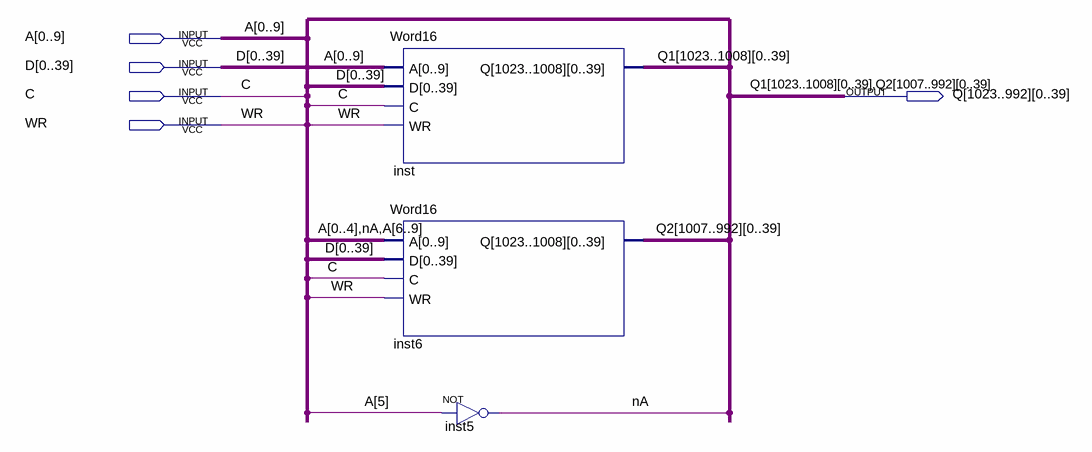
[diagram p0: schematic sheet]
// Quartus schematic Word32.bdf as structural Verilog: 3 symbols, 5 pins
module Word32 (
  input  [0:9] A,
  input  [0:39] D,
  input  C,
  input  WR,
  output [39:0] Q_1023,
  output [39:0] Q_1022,
  output [39:0] Q_1021,
  output [39:0] Q_1020,
  output [39:0] Q_1019,
  output [39:0] Q_1018,
  output [39:0] Q_1017,
  output [39:0] Q_1016,
  output [39:0] Q_1015,
  output [39:0] Q_1014,
  output [39:0] Q_1013,
  output [39:0] Q_1012,
  output [39:0] Q_1011,
  output [39:0] Q_1010,
  output [39:0] Q_1009,
  output [39:0] Q_1008,
  output [39:0] Q_1007,
  output [39:0] Q_1006,
  output [39:0] Q_1005,
  output [39:0] Q_1004,
  output [39:0] Q_1003,
  output [39:0] Q_1002,
  output [39:0] Q_1001,
  output [39:0] Q_1000,
  output [39:0] Q_999,
  output [39:0] Q_998,
  output [39:0] Q_997,
  output [39:0] Q_996,
  output [39:0] Q_995,
  output [39:0] Q_994,
  output [39:0] Q_993,
  output [39:0] Q_992
);

  wire nA;

  Word16 inst (
    .A(A), .D(D), .C(C), .WR(WR),
    .Q({Q_1023[0], Q_1023[1], Q_1023[2], Q_1023[3], Q_1023[4], Q_1023[5], Q_1023[6], Q_1023[7], Q_1023[8], Q_1023[9], Q_1023[10], Q_1023[11], Q_1023[12], Q_1023[13], Q_1023[14], Q_1023[15], Q_1023[16], Q_1023[17], Q_1023[18], Q_1023[19], Q_1023[20], Q_1023[21], Q_1023[22], Q_1023[23], Q_1023[24], Q_1023[25], Q_1023[26], Q_1023[27], Q_1023[28], Q_1023[29], Q_1023[30], Q_1023[31], Q_1023[32], Q_1023[33], Q_1023[34], Q_1023[35], Q_1023[36], Q_1023[37], Q_1023[38], Q_1023[39], Q_1022[0], Q_1022[1], Q_1022[2], Q_1022[3], Q_1022[4], Q_1022[5], Q_1022[6], Q_1022[7], Q_1022[8], Q_1022[9], Q_1022[10], Q_1022[11], Q_1022[12], Q_1022[13], Q_1022[14], Q_1022[15], Q_1022[16], Q_1022[17], Q_1022[18], Q_1022[19], Q_1022[20], Q_1022[21], Q_1022[22], Q_1022[23], Q_1022[24], Q_1022[25], Q_1022[26], Q_1022[27], Q_1022[28], Q_1022[29], Q_1022[30], Q_1022[31], Q_1022[32], Q_1022[33], Q_1022[34], Q_1022[35], Q_1022[36], Q_1022[37], Q_1022[38], Q_1022[39], Q_1021[0], Q_1021[1], Q_1021[2], Q_1021[3], Q_1021[4], Q_1021[5], Q_1021[6], Q_1021[7], Q_1021[8], Q_1021[9], Q_1021[10], Q_1021[11], Q_1021[12], Q_1021[13], Q_1021[14], Q_1021[15], Q_1021[16], Q_1021[17], Q_1021[18], Q_1021[19], Q_1021[20], Q_1021[21], Q_1021[22], Q_1021[23], Q_1021[24], Q_1021[25], Q_1021[26], Q_1021[27], Q_1021[28], Q_1021[29], Q_1021[30], Q_1021[31], Q_1021[32], Q_1021[33], Q_1021[34], Q_1021[35], Q_1021[36], Q_1021[37], Q_1021[38], Q_1021[39], Q_1020[0], Q_1020[1], Q_1020[2], Q_1020[3], Q_1020[4], Q_1020[5], Q_1020[6], Q_1020[7], Q_1020[8], Q_1020[9], Q_1020[10], Q_1020[11], Q_1020[12], Q_1020[13], Q_1020[14], Q_1020[15], Q_1020[16], Q_1020[17], Q_1020[18], Q_1020[19], Q_1020[20], Q_1020[21], Q_1020[22], Q_1020[23], Q_1020[24], Q_1020[25], Q_1020[26], Q_1020[27], Q_1020[28], Q_1020[29], Q_1020[30], Q_1020[31], Q_1020[32], Q_1020[33], Q_1020[34], Q_1020[35], Q_1020[36], Q_1020[37], Q_1020[38], Q_1020[39], Q_1019[0], Q_1019[1], Q_1019[2], Q_1019[3], Q_1019[4], Q_1019[5], Q_1019[6], Q_1019[7], Q_1019[8], Q_1019[9], Q_1019[10], Q_1019[11], Q_1019[12], Q_1019[13], Q_1019[14], Q_1019[15], Q_1019[16], Q_1019[17], Q_1019[18], Q_1019[19], Q_1019[20], Q_1019[21], Q_1019[22], Q_1019[23], Q_1019[24], Q_1019[25], Q_1019[26], Q_1019[27], Q_1019[28], Q_1019[29], Q_1019[30], Q_1019[31], Q_1019[32], Q_1019[33], Q_1019[34], Q_1019[35], Q_1019[36], Q_1019[37], Q_1019[38], Q_1019[39], Q_1018[0], Q_1018[1], Q_1018[2], Q_1018[3], Q_1018[4], Q_1018[5], Q_1018[6], Q_1018[7], Q_1018[8], Q_1018[9], Q_1018[10], Q_1018[11], Q_1018[12], Q_1018[13], Q_1018[14], Q_1018[15], Q_1018[16], Q_1018[17], Q_1018[18], Q_1018[19], Q_1018[20], Q_1018[21], Q_1018[22], Q_1018[23], Q_1018[24], Q_1018[25], Q_1018[26], Q_1018[27], Q_1018[28], Q_1018[29], Q_1018[30], Q_1018[31], Q_1018[32], Q_1018[33], Q_1018[34], Q_1018[35], Q_1018[36], Q_1018[37], Q_1018[38], Q_1018[39], Q_1017[0], Q_1017[1], Q_1017[2], Q_1017[3], Q_1017[4], Q_1017[5], Q_1017[6], Q_1017[7], Q_1017[8], Q_1017[9], Q_1017[10], Q_1017[11], Q_1017[12], Q_1017[13], Q_1017[14], Q_1017[15], Q_1017[16], Q_1017[17], Q_1017[18], Q_1017[19], Q_1017[20], Q_1017[21], Q_1017[22], Q_1017[23], Q_1017[24], Q_1017[25], Q_1017[26], Q_1017[27], Q_1017[28], Q_1017[29], Q_1017[30], Q_1017[31], Q_1017[32], Q_1017[33], Q_1017[34], Q_1017[35], Q_1017[36], Q_1017[37], Q_1017[38], Q_1017[39], Q_1016[0], Q_1016[1], Q_1016[2], Q_1016[3], Q_1016[4], Q_1016[5], Q_1016[6], Q_1016[7], Q_1016[8], Q_1016[9], Q_1016[10], Q_1016[11], Q_1016[12], Q_1016[13], Q_1016[14], Q_1016[15], Q_1016[16], Q_1016[17], Q_1016[18], Q_1016[19], Q_1016[20], Q_1016[21], Q_1016[22], Q_1016[23], Q_1016[24], Q_1016[25], Q_1016[26], Q_1016[27], Q_1016[28], Q_1016[29], Q_1016[30], Q_1016[31], Q_1016[32], Q_1016[33], Q_1016[34], Q_1016[35], Q_1016[36], Q_1016[37], Q_1016[38], Q_1016[39], Q_1015[0], Q_1015[1], Q_1015[2], Q_1015[3], Q_1015[4], Q_1015[5], Q_1015[6], Q_1015[7], Q_1015[8], Q_1015[9], Q_1015[10], Q_1015[11], Q_1015[12], Q_1015[13], Q_1015[14], Q_1015[15], Q_1015[16], Q_1015[17], Q_1015[18], Q_1015[19], Q_1015[20], Q_1015[21], Q_1015[22], Q_1015[23], Q_1015[24], Q_1015[25], Q_1015[26], Q_1015[27], Q_1015[28], Q_1015[29], Q_1015[30], Q_1015[31], Q_1015[32], Q_1015[33], Q_1015[34], Q_1015[35], Q_1015[36], Q_1015[37], Q_1015[38], Q_1015[39], Q_1014[0], Q_1014[1], Q_1014[2], Q_1014[3], Q_1014[4], Q_1014[5], Q_1014[6], Q_1014[7], Q_1014[8], Q_1014[9], Q_1014[10], Q_1014[11], Q_1014[12], Q_1014[13], Q_1014[14], Q_1014[15], Q_1014[16], Q_1014[17], Q_1014[18], Q_1014[19], Q_1014[20], Q_1014[21], Q_1014[22], Q_1014[23], Q_1014[24], Q_1014[25], Q_1014[26], Q_1014[27], Q_1014[28], Q_1014[29], Q_1014[30], Q_1014[31], Q_1014[32], Q_1014[33], Q_1014[34], Q_1014[35], Q_1014[36], Q_1014[37], Q_1014[38], Q_1014[39], Q_1013[0], Q_1013[1], Q_1013[2], Q_1013[3], Q_1013[4], Q_1013[5], Q_1013[6], Q_1013[7], Q_1013[8], Q_1013[9], Q_1013[10], Q_1013[11], Q_1013[12], Q_1013[13], Q_1013[14], Q_1013[15], Q_1013[16], Q_1013[17], Q_1013[18], Q_1013[19], Q_1013[20], Q_1013[21], Q_1013[22], Q_1013[23], Q_1013[24], Q_1013[25], Q_1013[26], Q_1013[27], Q_1013[28], Q_1013[29], Q_1013[30], Q_1013[31], Q_1013[32], Q_1013[33], Q_1013[34], Q_1013[35], Q_1013[36], Q_1013[37], Q_1013[38], Q_1013[39], Q_1012[0], Q_1012[1], Q_1012[2], Q_1012[3], Q_1012[4], Q_1012[5], Q_1012[6], Q_1012[7], Q_1012[8], Q_1012[9], Q_1012[10], Q_1012[11], Q_1012[12], Q_1012[13], Q_1012[14], Q_1012[15], Q_1012[16], Q_1012[17], Q_1012[18], Q_1012[19], Q_1012[20], Q_1012[21], Q_1012[22], Q_1012[23], Q_1012[24], Q_1012[25], Q_1012[26], Q_1012[27], Q_1012[28], Q_1012[29], Q_1012[30], Q_1012[31], Q_1012[32], Q_1012[33], Q_1012[34], Q_1012[35], Q_1012[36], Q_1012[37], Q_1012[38], Q_1012[39], Q_1011[0], Q_1011[1], Q_1011[2], Q_1011[3], Q_1011[4], Q_1011[5], Q_1011[6], Q_1011[7], Q_1011[8], Q_1011[9], Q_1011[10], Q_1011[11], Q_1011[12], Q_1011[13], Q_1011[14], Q_1011[15], Q_1011[16], Q_1011[17], Q_1011[18], Q_1011[19], Q_1011[20], Q_1011[21], Q_1011[22], Q_1011[23], Q_1011[24], Q_1011[25], Q_1011[26], Q_1011[27], Q_1011[28], Q_1011[29], Q_1011[30], Q_1011[31], Q_1011[32], Q_1011[33], Q_1011[34], Q_1011[35], Q_1011[36], Q_1011[37], Q_1011[38], Q_1011[39], Q_1010[0], Q_1010[1], Q_1010[2], Q_1010[3], Q_1010[4], Q_1010[5], Q_1010[6], Q_1010[7], Q_1010[8], Q_1010[9], Q_1010[10], Q_1010[11], Q_1010[12], Q_1010[13], Q_1010[14], Q_1010[15], Q_1010[16], Q_1010[17], Q_1010[18], Q_1010[19], Q_1010[20], Q_1010[21], Q_1010[22], Q_1010[23], Q_1010[24], Q_1010[25], Q_1010[26], Q_1010[27], Q_1010[28], Q_1010[29], Q_1010[30], Q_1010[31], Q_1010[32], Q_1010[33], Q_1010[34], Q_1010[35], Q_1010[36], Q_1010[37], Q_1010[38], Q_1010[39], Q_1009[0], Q_1009[1], Q_1009[2], Q_1009[3], Q_1009[4], Q_1009[5], Q_1009[6], Q_1009[7], Q_1009[8], Q_1009[9], Q_1009[10], Q_1009[11], Q_1009[12], Q_1009[13], Q_1009[14], Q_1009[15], Q_1009[16], Q_1009[17], Q_1009[18], Q_1009[19], Q_1009[20], Q_1009[21], Q_1009[22], Q_1009[23], Q_1009[24], Q_1009[25], Q_1009[26], Q_1009[27], Q_1009[28], Q_1009[29], Q_1009[30], Q_1009[31], Q_1009[32], Q_1009[33], Q_1009[34], Q_1009[35], Q_1009[36], Q_1009[37], Q_1009[38], Q_1009[39], Q_1008[0], Q_1008[1], Q_1008[2], Q_1008[3], Q_1008[4], Q_1008[5], Q_1008[6], Q_1008[7], Q_1008[8], Q_1008[9], Q_1008[10], Q_1008[11], Q_1008[12], Q_1008[13], Q_1008[14], Q_1008[15], Q_1008[16], Q_1008[17], Q_1008[18], Q_1008[19], Q_1008[20], Q_1008[21], Q_1008[22], Q_1008[23], Q_1008[24], Q_1008[25], Q_1008[26], Q_1008[27], Q_1008[28], Q_1008[29], Q_1008[30], Q_1008[31], Q_1008[32], Q_1008[33], Q_1008[34], Q_1008[35], Q_1008[36], Q_1008[37], Q_1008[38], Q_1008[39]}));
  Word16 inst6 (
    .A({A[0:4], nA, A[6:9]}), .D(D), .C(C), .WR(WR),
    .Q({Q_1007[0], Q_1007[1], Q_1007[2], Q_1007[3], Q_1007[4], Q_1007[5], Q_1007[6], Q_1007[7], Q_1007[8], Q_1007[9], Q_1007[10], Q_1007[11], Q_1007[12], Q_1007[13], Q_1007[14], Q_1007[15], Q_1007[16], Q_1007[17], Q_1007[18], Q_1007[19], Q_1007[20], Q_1007[21], Q_1007[22], Q_1007[23], Q_1007[24], Q_1007[25], Q_1007[26], Q_1007[27], Q_1007[28], Q_1007[29], Q_1007[30], Q_1007[31], Q_1007[32], Q_1007[33], Q_1007[34], Q_1007[35], Q_1007[36], Q_1007[37], Q_1007[38], Q_1007[39], Q_1006[0], Q_1006[1], Q_1006[2], Q_1006[3], Q_1006[4], Q_1006[5], Q_1006[6], Q_1006[7], Q_1006[8], Q_1006[9], Q_1006[10], Q_1006[11], Q_1006[12], Q_1006[13], Q_1006[14], Q_1006[15], Q_1006[16], Q_1006[17], Q_1006[18], Q_1006[19], Q_1006[20], Q_1006[21], Q_1006[22], Q_1006[23], Q_1006[24], Q_1006[25], Q_1006[26], Q_1006[27], Q_1006[28], Q_1006[29], Q_1006[30], Q_1006[31], Q_1006[32], Q_1006[33], Q_1006[34], Q_1006[35], Q_1006[36], Q_1006[37], Q_1006[38], Q_1006[39], Q_1005[0], Q_1005[1], Q_1005[2], Q_1005[3], Q_1005[4], Q_1005[5], Q_1005[6], Q_1005[7], Q_1005[8], Q_1005[9], Q_1005[10], Q_1005[11], Q_1005[12], Q_1005[13], Q_1005[14], Q_1005[15], Q_1005[16], Q_1005[17], Q_1005[18], Q_1005[19], Q_1005[20], Q_1005[21], Q_1005[22], Q_1005[23], Q_1005[24], Q_1005[25], Q_1005[26], Q_1005[27], Q_1005[28], Q_1005[29], Q_1005[30], Q_1005[31], Q_1005[32], Q_1005[33], Q_1005[34], Q_1005[35], Q_1005[36], Q_1005[37], Q_1005[38], Q_1005[39], Q_1004[0], Q_1004[1], Q_1004[2], Q_1004[3], Q_1004[4], Q_1004[5], Q_1004[6], Q_1004[7], Q_1004[8], Q_1004[9], Q_1004[10], Q_1004[11], Q_1004[12], Q_1004[13], Q_1004[14], Q_1004[15], Q_1004[16], Q_1004[17], Q_1004[18], Q_1004[19], Q_1004[20], Q_1004[21], Q_1004[22], Q_1004[23], Q_1004[24], Q_1004[25], Q_1004[26], Q_1004[27], Q_1004[28], Q_1004[29], Q_1004[30], Q_1004[31], Q_1004[32], Q_1004[33], Q_1004[34], Q_1004[35], Q_1004[36], Q_1004[37], Q_1004[38], Q_1004[39], Q_1003[0], Q_1003[1], Q_1003[2], Q_1003[3], Q_1003[4], Q_1003[5], Q_1003[6], Q_1003[7], Q_1003[8], Q_1003[9], Q_1003[10], Q_1003[11], Q_1003[12], Q_1003[13], Q_1003[14], Q_1003[15], Q_1003[16], Q_1003[17], Q_1003[18], Q_1003[19], Q_1003[20], Q_1003[21], Q_1003[22], Q_1003[23], Q_1003[24], Q_1003[25], Q_1003[26], Q_1003[27], Q_1003[28], Q_1003[29], Q_1003[30], Q_1003[31], Q_1003[32], Q_1003[33], Q_1003[34], Q_1003[35], Q_1003[36], Q_1003[37], Q_1003[38], Q_1003[39], Q_1002[0], Q_1002[1], Q_1002[2], Q_1002[3], Q_1002[4], Q_1002[5], Q_1002[6], Q_1002[7], Q_1002[8], Q_1002[9], Q_1002[10], Q_1002[11], Q_1002[12], Q_1002[13], Q_1002[14], Q_1002[15], Q_1002[16], Q_1002[17], Q_1002[18], Q_1002[19], Q_1002[20], Q_1002[21], Q_1002[22], Q_1002[23], Q_1002[24], Q_1002[25], Q_1002[26], Q_1002[27], Q_1002[28], Q_1002[29], Q_1002[30], Q_1002[31], Q_1002[32], Q_1002[33], Q_1002[34], Q_1002[35], Q_1002[36], Q_1002[37], Q_1002[38], Q_1002[39], Q_1001[0], Q_1001[1], Q_1001[2], Q_1001[3], Q_1001[4], Q_1001[5], Q_1001[6], Q_1001[7], Q_1001[8], Q_1001[9], Q_1001[10], Q_1001[11], Q_1001[12], Q_1001[13], Q_1001[14], Q_1001[15], Q_1001[16], Q_1001[17], Q_1001[18], Q_1001[19], Q_1001[20], Q_1001[21], Q_1001[22], Q_1001[23], Q_1001[24], Q_1001[25], Q_1001[26], Q_1001[27], Q_1001[28], Q_1001[29], Q_1001[30], Q_1001[31], Q_1001[32], Q_1001[33], Q_1001[34], Q_1001[35], Q_1001[36], Q_1001[37], Q_1001[38], Q_1001[39], Q_1000[0], Q_1000[1], Q_1000[2], Q_1000[3], Q_1000[4], Q_1000[5], Q_1000[6], Q_1000[7], Q_1000[8], Q_1000[9], Q_1000[10], Q_1000[11], Q_1000[12], Q_1000[13], Q_1000[14], Q_1000[15], Q_1000[16], Q_1000[17], Q_1000[18], Q_1000[19], Q_1000[20], Q_1000[21], Q_1000[22], Q_1000[23], Q_1000[24], Q_1000[25], Q_1000[26], Q_1000[27], Q_1000[28], Q_1000[29], Q_1000[30], Q_1000[31], Q_1000[32], Q_1000[33], Q_1000[34], Q_1000[35], Q_1000[36], Q_1000[37], Q_1000[38], Q_1000[39], Q_999[0], Q_999[1], Q_999[2], Q_999[3], Q_999[4], Q_999[5], Q_999[6], Q_999[7], Q_999[8], Q_999[9], Q_999[10], Q_999[11], Q_999[12], Q_999[13], Q_999[14], Q_999[15], Q_999[16], Q_999[17], Q_999[18], Q_999[19], Q_999[20], Q_999[21], Q_999[22], Q_999[23], Q_999[24], Q_999[25], Q_999[26], Q_999[27], Q_999[28], Q_999[29], Q_999[30], Q_999[31], Q_999[32], Q_999[33], Q_999[34], Q_999[35], Q_999[36], Q_999[37], Q_999[38], Q_999[39], Q_998[0], Q_998[1], Q_998[2], Q_998[3], Q_998[4], Q_998[5], Q_998[6], Q_998[7], Q_998[8], Q_998[9], Q_998[10], Q_998[11], Q_998[12], Q_998[13], Q_998[14], Q_998[15], Q_998[16], Q_998[17], Q_998[18], Q_998[19], Q_998[20], Q_998[21], Q_998[22], Q_998[23], Q_998[24], Q_998[25], Q_998[26], Q_998[27], Q_998[28], Q_998[29], Q_998[30], Q_998[31], Q_998[32], Q_998[33], Q_998[34], Q_998[35], Q_998[36], Q_998[37], Q_998[38], Q_998[39], Q_997[0], Q_997[1], Q_997[2], Q_997[3], Q_997[4], Q_997[5], Q_997[6], Q_997[7], Q_997[8], Q_997[9], Q_997[10], Q_997[11], Q_997[12], Q_997[13], Q_997[14], Q_997[15], Q_997[16], Q_997[17], Q_997[18], Q_997[19], Q_997[20], Q_997[21], Q_997[22], Q_997[23], Q_997[24], Q_997[25], Q_997[26], Q_997[27], Q_997[28], Q_997[29], Q_997[30], Q_997[31], Q_997[32], Q_997[33], Q_997[34], Q_997[35], Q_997[36], Q_997[37], Q_997[38], Q_997[39], Q_996[0], Q_996[1], Q_996[2], Q_996[3], Q_996[4], Q_996[5], Q_996[6], Q_996[7], Q_996[8], Q_996[9], Q_996[10], Q_996[11], Q_996[12], Q_996[13], Q_996[14], Q_996[15], Q_996[16], Q_996[17], Q_996[18], Q_996[19], Q_996[20], Q_996[21], Q_996[22], Q_996[23], Q_996[24], Q_996[25], Q_996[26], Q_996[27], Q_996[28], Q_996[29], Q_996[30], Q_996[31], Q_996[32], Q_996[33], Q_996[34], Q_996[35], Q_996[36], Q_996[37], Q_996[38], Q_996[39], Q_995[0], Q_995[1], Q_995[2], Q_995[3], Q_995[4], Q_995[5], Q_995[6], Q_995[7], Q_995[8], Q_995[9], Q_995[10], Q_995[11], Q_995[12], Q_995[13], Q_995[14], Q_995[15], Q_995[16], Q_995[17], Q_995[18], Q_995[19], Q_995[20], Q_995[21], Q_995[22], Q_995[23], Q_995[24], Q_995[25], Q_995[26], Q_995[27], Q_995[28], Q_995[29], Q_995[30], Q_995[31], Q_995[32], Q_995[33], Q_995[34], Q_995[35], Q_995[36], Q_995[37], Q_995[38], Q_995[39], Q_994[0], Q_994[1], Q_994[2], Q_994[3], Q_994[4], Q_994[5], Q_994[6], Q_994[7], Q_994[8], Q_994[9], Q_994[10], Q_994[11], Q_994[12], Q_994[13], Q_994[14], Q_994[15], Q_994[16], Q_994[17], Q_994[18], Q_994[19], Q_994[20], Q_994[21], Q_994[22], Q_994[23], Q_994[24], Q_994[25], Q_994[26], Q_994[27], Q_994[28], Q_994[29], Q_994[30], Q_994[31], Q_994[32], Q_994[33], Q_994[34], Q_994[35], Q_994[36], Q_994[37], Q_994[38], Q_994[39], Q_993[0], Q_993[1], Q_993[2], Q_993[3], Q_993[4], Q_993[5], Q_993[6], Q_993[7], Q_993[8], Q_993[9], Q_993[10], Q_993[11], Q_993[12], Q_993[13], Q_993[14], Q_993[15], Q_993[16], Q_993[17], Q_993[18], Q_993[19], Q_993[20], Q_993[21], Q_993[22], Q_993[23], Q_993[24], Q_993[25], Q_993[26], Q_993[27], Q_993[28], Q_993[29], Q_993[30], Q_993[31], Q_993[32], Q_993[33], Q_993[34], Q_993[35], Q_993[36], Q_993[37], Q_993[38], Q_993[39], Q_992[0], Q_992[1], Q_992[2], Q_992[3], Q_992[4], Q_992[5], Q_992[6], Q_992[7], Q_992[8], Q_992[9], Q_992[10], Q_992[11], Q_992[12], Q_992[13], Q_992[14], Q_992[15], Q_992[16], Q_992[17], Q_992[18], Q_992[19], Q_992[20], Q_992[21], Q_992[22], Q_992[23], Q_992[24], Q_992[25], Q_992[26], Q_992[27], Q_992[28], Q_992[29], Q_992[30], Q_992[31], Q_992[32], Q_992[33], Q_992[34], Q_992[35], Q_992[36], Q_992[37], Q_992[38], Q_992[39]}));
  not inst5 (nA, A[5]);

  // Other names for the same wires on the sheet: Q1_1008[39:0] = Q_1008; Q1_1009[39:0] = Q_1009;
  //   Q1_1010[39:0] = Q_1010; Q1_1011[39:0] = Q_1011; Q1_1012[39:0] = Q_1012; Q1_1013[39:0] = Q_1013;
  //   Q1_1014[39:0] = Q_1014; Q1_1015[39:0] = Q_1015; Q1_1016[39:0] = Q_1016; Q1_1017[39:0] = Q_1017;
  //   Q1_1018[39:0] = Q_1018; Q1_1019[39:0] = Q_1019; Q1_1020[39:0] = Q_1020; Q1_1021[39:0] = Q_1021;
  //   Q1_1022[39:0] = Q_1022; Q1_1023[39:0] = Q_1023; Q2_992[39:0] = Q_992; Q2_993[39:0] = Q_993;
  //   Q2_994[39:0] = Q_994; Q2_995[39:0] = Q_995; Q2_996[39:0] = Q_996; Q2_997[39:0] = Q_997; Q2_998[39:0] = Q_998;
  //   Q2_999[39:0] = Q_999; Q2_1000[39:0] = Q_1000; Q2_1001[39:0] = Q_1001; Q2_1002[39:0] = Q_1002;
  //   Q2_1003[39:0] = Q_1003; Q2_1004[39:0] = Q_1004; Q2_1005[39:0] = Q_1005; Q2_1006[39:0] = Q_1006;
  //   Q2_1007[39:0] = Q_1007
endmodule
